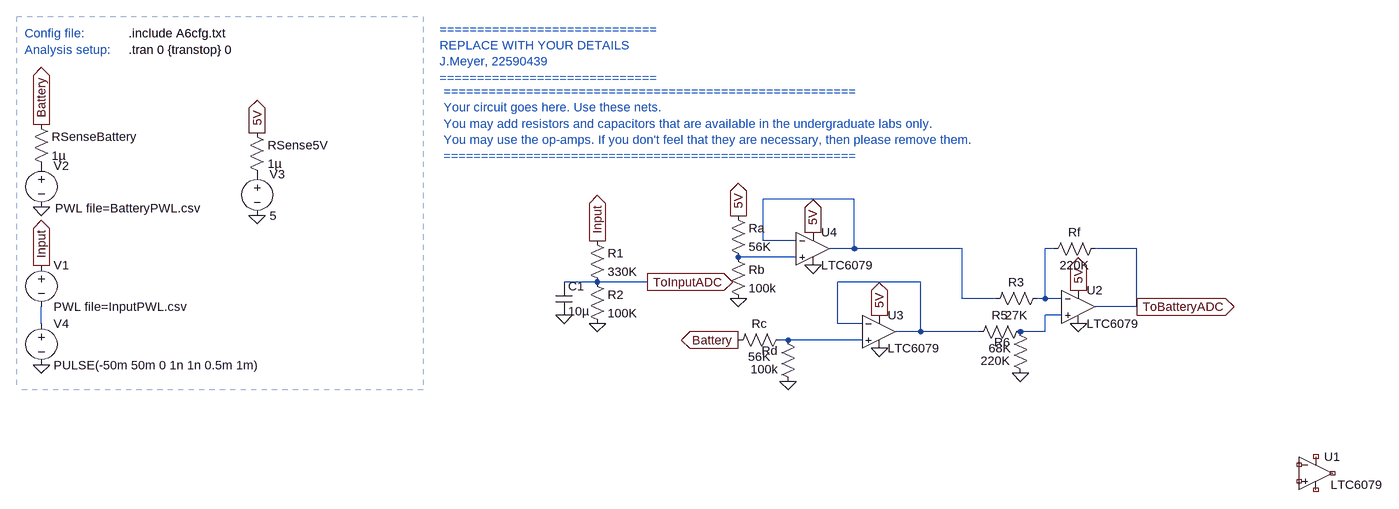
[diagram p0: schematic E344_22590439_A6.asc]
E344_22590439_A6.asc, the LTspice schematic file:
Version 4
SHEET 1 7780 4344
WIRE -752 -1072 -928 -1072
WIRE -928 -992 -928 -1072
WIRE -864 -992 -928 -992
WIRE -752 -976 -752 -1072
WIRE -752 -976 -800 -976
WIRE -544 -976 -752 -976
WIRE -368 -976 -384 -976
WIRE -208 -976 -288 -976
WIRE -864 -960 -976 -960
WIRE -1248 -912 -1312 -912
WIRE -1152 -912 -1248 -912
WIRE -624 -912 -784 -912
WIRE -544 -880 -544 -976
WIRE -480 -880 -544 -880
WIRE -384 -880 -384 -976
WIRE -384 -880 -400 -880
WIRE -352 -880 -384 -880
WIRE -208 -864 -208 -976
WIRE -208 -864 -288 -864
WIRE -352 -848 -384 -848
WIRE -2320 -832 -2320 -864
WIRE -784 -832 -784 -912
WIRE -736 -832 -784 -832
WIRE -624 -816 -624 -912
WIRE -624 -816 -672 -816
WIRE -512 -816 -624 -816
WIRE -384 -816 -384 -848
WIRE -384 -816 -432 -816
WIRE -880 -800 -896 -800
WIRE -736 -800 -880 -800
FLAG -2320 -944 Input
IOPIN -2320 -944 Out
FLAG -1904 -1040 0
FLAG -1248 -832 0
FLAG -2320 -752 0
FLAG -2320 -1056 0
FLAG -1152 -912 ToInputADC
IOPIN -1152 -912 Out
FLAG -208 -864 ToBatteryADC
IOPIN -208 -864 Out
FLAG -1904 -1200 5V
IOPIN -1904 -1200 Out
FLAG -2320 -1216 Battery
IOPIN -2320 -1216 Out
FLAG -976 -800 Battery
IOPIN -976 -800 Out
FLAG -1248 -992 Input
IOPIN -1248 -992 Out
FLAG -704 -848 5V
IOPIN -704 -848 Out
FLAG -1312 -848 0
FLAG -320 -896 5V
IOPIN -320 -896 Out
FLAG -832 -1008 5V
IOPIN -832 -1008 Out
FLAG -704 -784 0
FLAG -320 -832 0
FLAG -432 -736 0
FLAG -832 -944 0
FLAG -976 -1040 5V
IOPIN -976 -1040 Out
FLAG -976 -880 0
FLAG -880 -720 0
SYMBOL voltage -2320 -960 R0
WINDOW 123 0 0 Left 0
WINDOW 39 0 0 Left 0
SYMATTR InstName V1
SYMATTR Value PWL file=InputPWL.csv
SYMBOL voltage -2320 -1152 R0
WINDOW 123 0 0 Left 0
WINDOW 39 0 0 Left 0
WINDOW 3 27 98 Left 2
SYMATTR Value PWL file=BatteryPWL.csv
SYMATTR InstName V2
SYMBOL voltage -1904 -1136 R0
WINDOW 123 0 0 Left 0
WINDOW 39 0 0 Left 0
SYMATTR InstName V3
SYMATTR Value 5
SYMBOL voltage -2320 -848 R0
WINDOW 123 0 0 Left 0
WINDOW 39 0 0 Left 0
SYMATTR InstName V4
SYMATTR Value PULSE(-50m 50m 0 1n 1n 0.5m 1m)
SYMBOL res -1920 -1216 R0
SYMATTR InstName RSense5V
SYMATTR Value 1µ
SYMBOL res -2336 -1232 R0
SYMATTR InstName RSenseBattery
SYMATTR Value 1µ
SYMBOL OpAmps\\LTC6079 7648 4304 R0
WINDOW 3 29 22 Left 2
SYMATTR InstName U1
SYMBOL OpAmps\\LTC6079 -320 -864 R0
SYMATTR InstName U2
SYMBOL OpAmps\\LTC6079 -704 -816 R0
SYMATTR InstName U3
SYMBOL res -1264 -1008 R0
SYMATTR InstName R1
SYMATTR Value 330K
SYMBOL res -1264 -928 R0
SYMATTR InstName R2
SYMATTR Value 100K
SYMBOL cap -1328 -912 R0
SYMATTR InstName C1
SYMATTR Value 10µ
SYMBOL res -384 -896 R90
WINDOW 0 0 56 VBottom 2
WINDOW 3 32 56 VTop 2
SYMATTR InstName R3
SYMATTR Value 27K
SYMBOL res -272 -992 R90
WINDOW 0 0 56 VBottom 2
WINDOW 3 32 56 VTop 2
SYMATTR InstName Rf
SYMATTR Value 220K
SYMBOL res -416 -832 R90
WINDOW 0 0 56 VBottom 2
WINDOW 3 32 56 VTop 2
SYMATTR InstName R5
SYMATTR Value 68K
SYMBOL res -416 -720 R180
WINDOW 0 36 76 Left 2
WINDOW 3 36 40 Left 2
SYMATTR InstName R6
SYMATTR Value 220K
SYMBOL OpAmps\\LTC6079 -832 -976 R0
SYMATTR InstName U4
SYMBOL res -992 -1056 R0
SYMATTR InstName Ra
SYMATTR Value 56K
SYMBOL res -992 -976 R0
SYMATTR InstName Rb
SYMATTR Value 100k
SYMBOL res -880 -816 R90
WINDOW 0 0 56 VBottom 2
WINDOW 3 32 56 VTop 2
SYMATTR InstName Rc
SYMATTR Value 56K
SYMBOL res -864 -704 R180
WINDOW 0 36 76 Left 2
WINDOW 3 36 40 Left 2
SYMATTR InstName Rd
SYMATTR Value 100k
TEXT -2152 -1360 Left 2 !.tran 0 {transtop} 0
TEXT -2152 -1392 Left 2 !.include A6cfg.txt
TEXT -2352 -1392 Left 2 ;Config file:
TEXT -2352 -1360 Left 2 ;Analysis setup:
TEXT -1552 -1400 Left 2 ;=============================\nREPLACE WITH YOUR DETAILS\nJ.Meyer, 22590439\n=============================
TEXT -1544 -1280 Left 2 ;=======================================================\nYour circuit goes here. Use these nets.\nYou may add resistors and capacitors that are available in the undergraduate labs only.\nYou may use the op-amps. If you don't feel that they are necessary, then please remove them.\n=======================================================
LINE Normal -1584 -1424 -1584 -704 2
LINE Normal -2368 -1424 -1584 -1424 2
LINE Normal -1584 -704 -2368 -704 2
LINE Normal -1584 -720 -1584 -720 2
LINE Normal -2368 -1424 -2368 -704 2

The netlist it stands for:
* E344_22590439_A6.asc
V1 Input N006 PWL file=InputPWL.csv
V2 P001 0 PWL file=BatteryPWL.csv
V3 P002 0 5
V4 N006 0 PULSE(-50m 50m 0 1n 1n 0.5m 1m)
RSense5V 5V P002 1µ
RSenseBattery Battery P001 1µ
XU1 NC_01 NC_02 NC_03 NC_04 NC_05 LTC6078  ; LTC6079, pins In+ In- V+ V- OUT
XU2 N005 N002 5V 0 ToBatteryADC LTC6078  ; LTC6079, pins In+ In- V+ V- OUT
XU3 N007 N004 5V 0 N004 LTC6078  ; LTC6079, pins In+ In- V+ V- OUT
R1 Input ToInputADC 330K
R2 ToInputADC 0 100K
C1 ToInputADC 0 10µ
R3 N002 N001 27K
Rf ToBatteryADC N002 220K
R5 N005 N004 68K
R6 0 N005 220K
XU4 N003 N001 5V 0 N001 LTC6078  ; LTC6079, pins In+ In- V+ V- OUT
Ra 5V N003 56K
Rb N003 0 100k
Rc N007 Battery 56K
Rd 0 N007 100k
.tran 0 {transtop} 0
.include A6cfg.txt
* Config file:
* Analysis setup:
* =============================
* REPLACE WITH YOUR DETAILS
* J.Meyer, 22590439
* =============================
* =======================================================
* Your circuit goes here. Use these nets.
* You may add resistors and capacitors that are available in the undergraduate labs only.
* You may use the op-amps. If you don't feel that they are necessary, then please remove them.
* =======================================================
.lib LTC5.lib
.backanno
.end